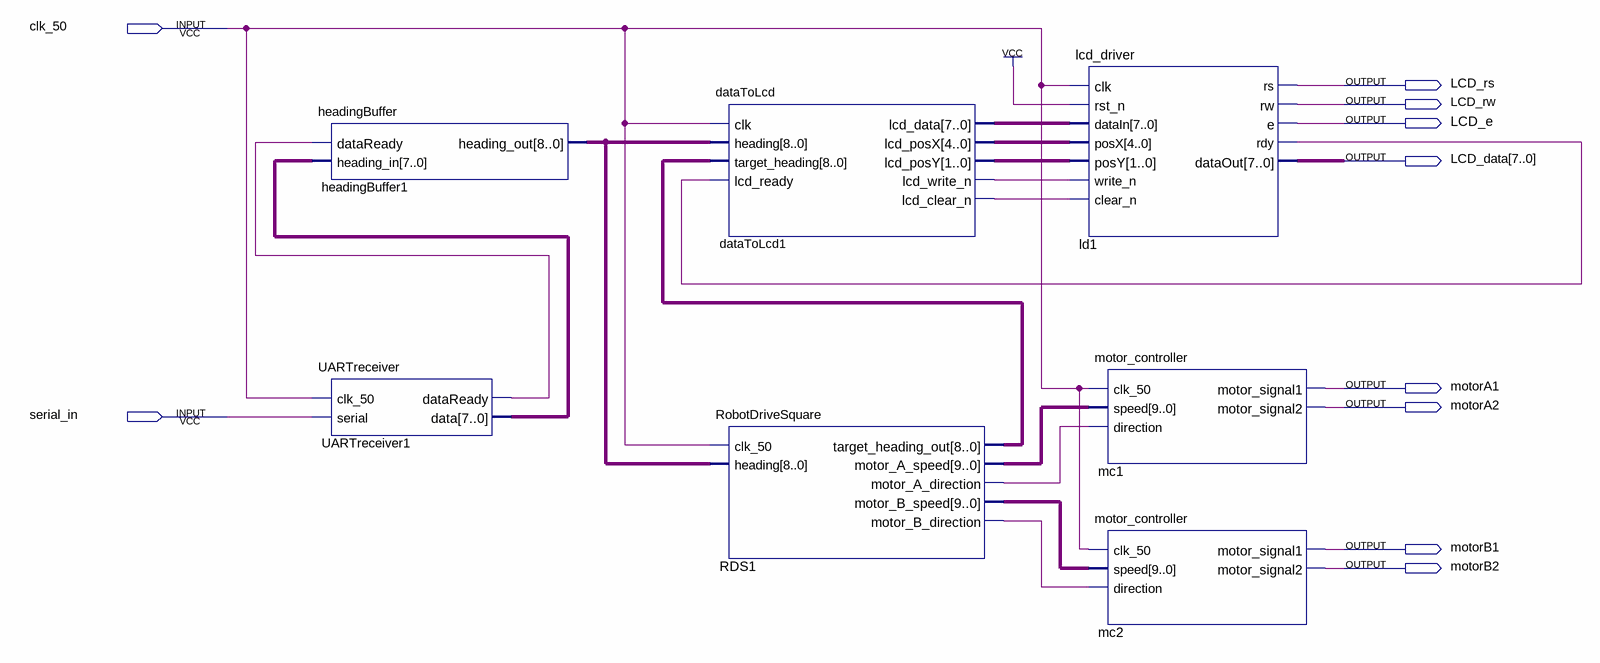
[diagram p0: schematic sheet]
// Quartus schematic TimeTurner.bdf as structural Verilog: 7 symbols, 10 pins
module TimeTurner (
  input  clk_50,
  input  serial_in,
  output LCD_rs,
  output LCD_rw,
  output LCD_e,
  output [7:0] LCD_data,
  output motorA1,
  output motorA2,
  output motorB1,
  output motorB2
);

  wire dataToLcd1_lcd_clear_n, dataToLcd1_lcd_write_n, ld1_rdy, RDS1_motor_a_direction,
       RDS1_motor_b_direction, UARTreceiver1_dataready;
  wire [1:0] dataToLcd1_lcd_posy;
  wire [4:0] dataToLcd1_lcd_posx;
  wire [7:0] dataToLcd1_lcd_data, UARTreceiver1_data;
  wire [8:0] headingBuffer1_heading_out, RDS1_target_heading_out;
  wire [9:0] RDS1_motor_a_speed, RDS1_motor_b_speed;

  headingBuffer headingBuffer1 (
    .dataReady(UARTreceiver1_dataready), .heading_in(UARTreceiver1_data),
    .heading_out(headingBuffer1_heading_out));
  UARTreceiver UARTreceiver1 (
    .clk_50(clk_50), .serial(serial_in), .dataReady(UARTreceiver1_dataready), .data(UARTreceiver1_data));
  dataToLcd dataToLcd1 (
    .clk(clk_50), .heading(headingBuffer1_heading_out), .target_heading(RDS1_target_heading_out),
    .lcd_ready(ld1_rdy), .lcd_data(dataToLcd1_lcd_data), .lcd_posX(dataToLcd1_lcd_posx),
    .lcd_posY(dataToLcd1_lcd_posy), .lcd_write_n(dataToLcd1_lcd_write_n), .lcd_clear_n(dataToLcd1_lcd_clear_n));
  RobotDriveSquare RDS1 (
    .clk_50(clk_50), .heading(headingBuffer1_heading_out), .target_heading_out(RDS1_target_heading_out),
    .motor_A_speed(RDS1_motor_a_speed), .motor_A_direction(RDS1_motor_a_direction),
    .motor_B_speed(RDS1_motor_b_speed), .motor_B_direction(RDS1_motor_b_direction));
  lcd_driver ld1 (
    .clk(clk_50), .rst_n(1'b1), .dataIn(dataToLcd1_lcd_data), .posX(dataToLcd1_lcd_posx),
    .posY(dataToLcd1_lcd_posy), .write_n(dataToLcd1_lcd_write_n), .clear_n(dataToLcd1_lcd_clear_n),
    .rs(LCD_rs), .rw(LCD_rw), .e(LCD_e), .rdy(ld1_rdy), .dataOut(LCD_data));
  motor_controller mc1 (
    .clk_50(clk_50), .speed(RDS1_motor_a_speed), .direction(RDS1_motor_a_direction), .motor_signal1(motorA1),
    .motor_signal2(motorA2));
  motor_controller mc2 (
    .clk_50(clk_50), .speed(RDS1_motor_b_speed), .direction(RDS1_motor_b_direction), .motor_signal1(motorB1),
    .motor_signal2(motorB2));
endmodule
